# Altium schematic sheet Output.SchDoc
size A; SheetNumber: 5; SheetTotal: 8
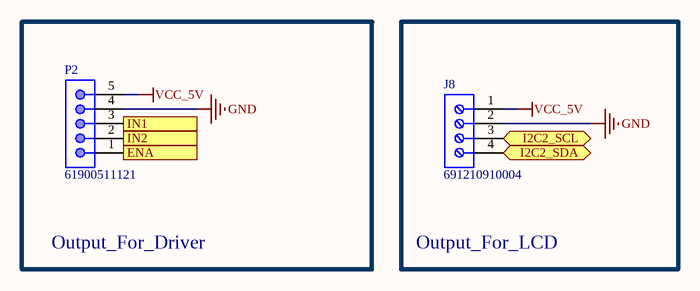
[diagram p0: Output.SchDoc]

## Parts
J8  691210910004  [691210910004]
P2  61900511121  [61900511121]

## Blocks framed on the sheet
Output_For_Driver: P2
Output_For_LCD: J8

## Ports
ENA (in), I2C2_SCL (bidir), I2C2_SDA (bidir), IN1 (in), IN2 (in)

## Nets
GND: J8.2 P2.4
VCC_5V: J8.1 P2.5
ENA: P2.1 ; port ENA
I2C2_SCL: J8.3 ; port I2C2_SCL
I2C2_SDA: J8.4 ; port I2C2_SDA
IN1: P2.3 ; port IN1
IN2: P2.2 ; port IN2

## Library data of the parts
J8 = 691210910004: WR-TBL Serie 2109 Horizontal Entry, Rising Cage Clamp, pitch 2.54mm, 4p; Compliance: Lead free / RoHS; Modularity: No; PCB/Cable/Panel: PCB; Pin Number: 4; Rated Current [UL]: 6A; Working Voltage [UL]: 150VAC; No. Pad (SMD): 0; ComponentLink1Description: Manufacturer; ComponentLink1URL: http://www.we-online.de; ComponentLink2URL: https://katalog.we-online.de/em/datasheet/691210910004.pdf; ComponentLink2Description: Datasheet; Mounting Technology: THT; Part Number: 691210910004; Packaging: Box; Operating Temperature: -40 to +105degC; Pitch: 2.54mm; Published Date: October 2019; Type: Horizontal; Publisher: Wurth Elektronik; Application: Rising Cage Clamp; No. Pad (THT): 4; Unit Price (Digikey): 1.96
P2 = 61900511121: WR-WTB THT Male Vertical Locking Header, pitch 2.54mm, 5p; Pin Number: 5; Contact Resistance: 20mOhm; Rated Current: 3A; Withstanding Voltage: 1000VAC; Working Voltage: 250VAC; No. Pad (SMD): 0; ComponentLink1Description: Manufacturer; ComponentLink1URL: http://www.we-online.de; ComponentLink2Description: Datasheet; ComponentLink2URL: https://www.we-online.com/catalog/datasheet/61900511121.pdf; Pitch: 2.54mm; Published Date: January 2020; Publisher: Wurth Elektronik; Mounting Technology: THT; Packaging: Bag; Operating Temperature: -40 to +105degC; Part Number: 61900511121; Gender: Male; Type: Vertical; No. Pad (THT): 5; Unit Price (Digikey): 1.22